# EAGLE schematic ETHERNET_PHY (EAGLE 8.4.0)
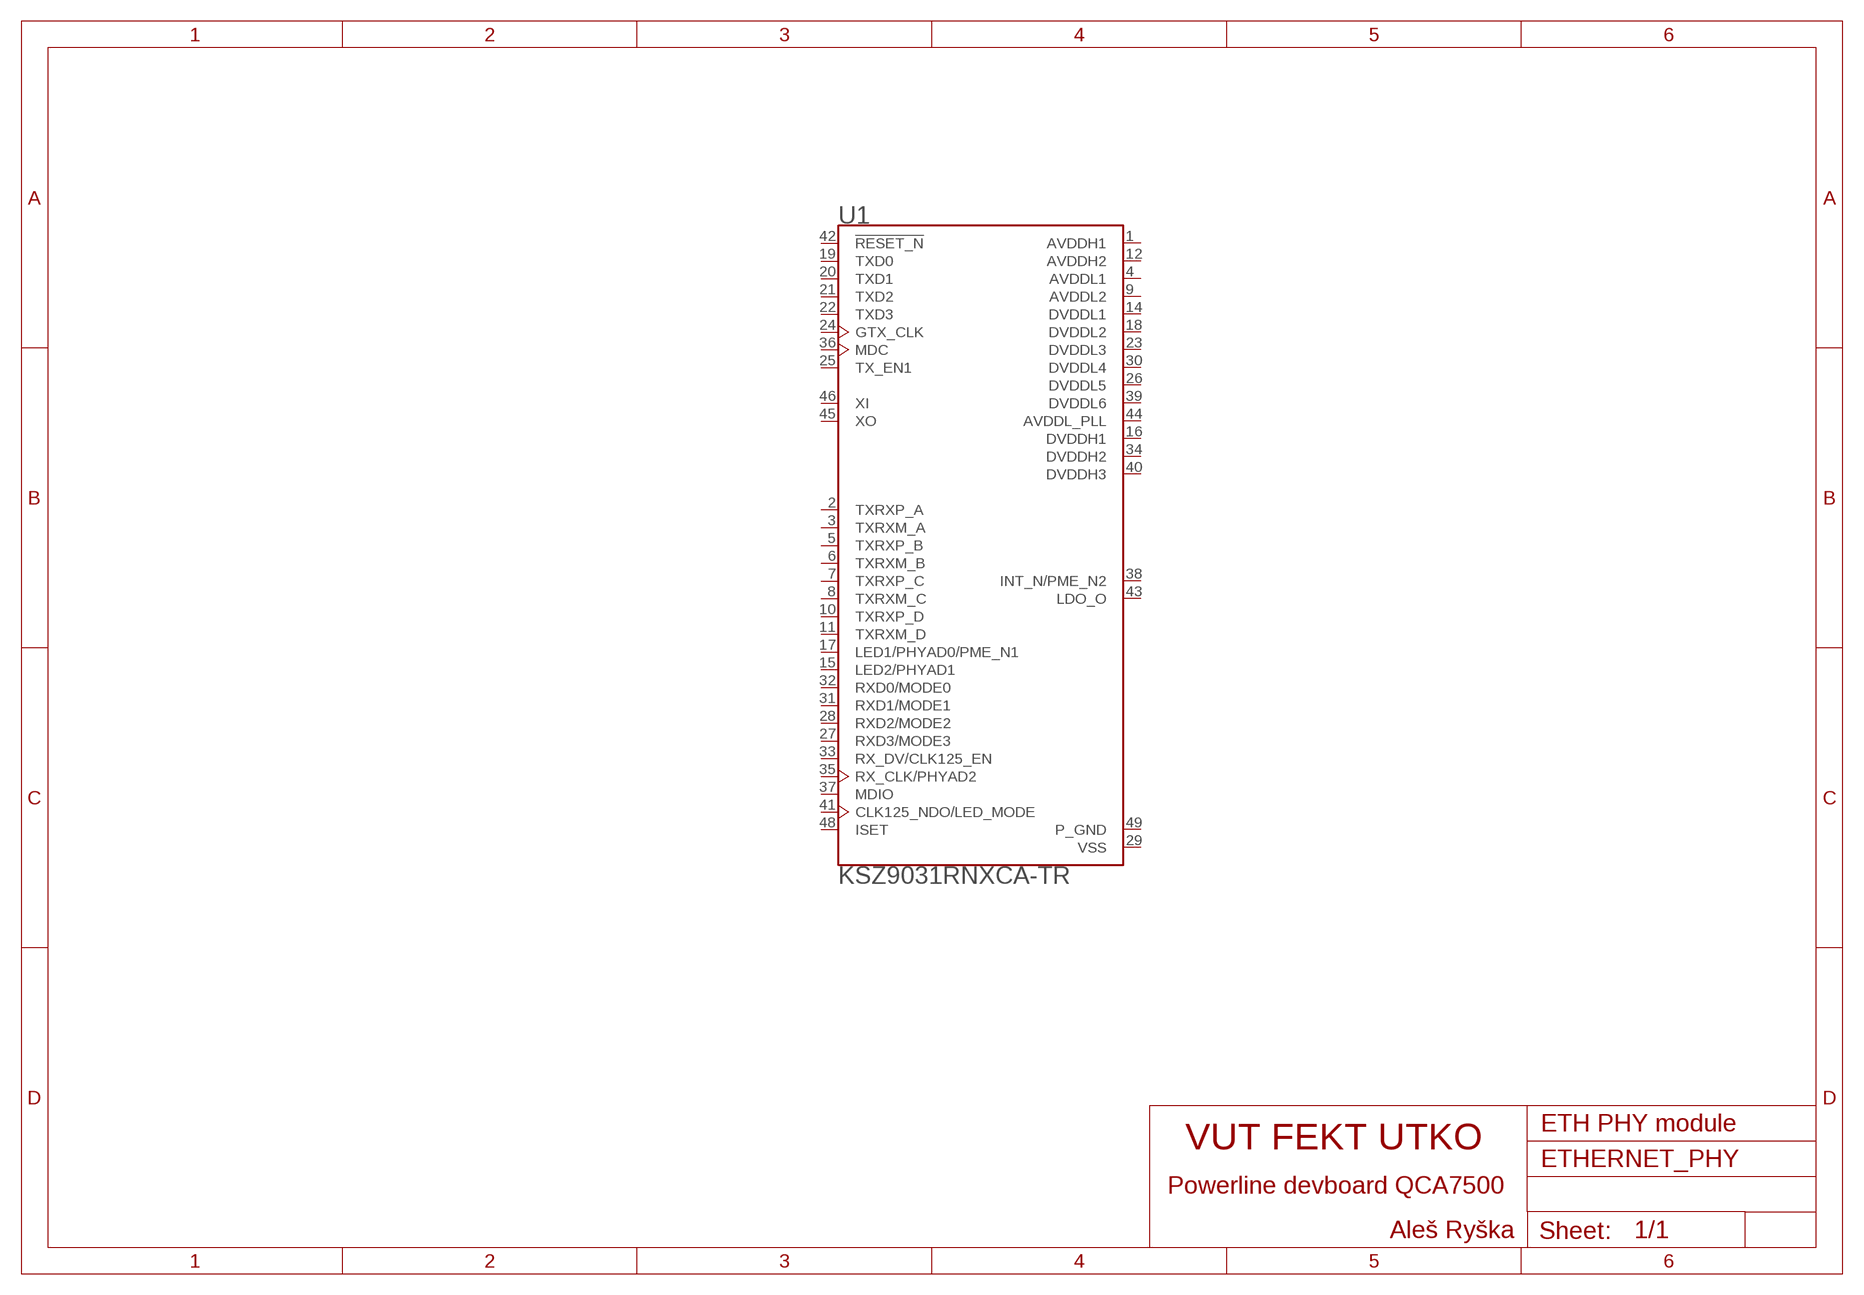
[diagram p0: schematic, sheet 1]

## Parts
U1  KSZ9031RNXCA-TR  [QFN50P700X700X90-49N]
Unconnected: U1.2(TXRXP_A) U1.3(TXRXM_A) U1.5(TXRXP_B) U1.6(TXRXM_B) U1.7(TXRXP_C) U1.8(TXRXM_C) U1.10(TXRXP_D) U1.11(TXRXM_D) U1.15(LED2/PHYAD1) U1.17(LED1/PHYAD0/PME_N1) U1.19(TXD0) U1.20(TXD1) U1.21(TXD2) U1.22(TXD3) U1.24(GTX_CLK) U1.25(TX_EN1) U1.27(RXD3/MODE3) U1.28(RXD2/MODE2) U1.31(RXD1/MODE1) U1.32(RXD0/MODE0) U1.33(RX_DV/CLK125_EN) U1.35(RX_CLK/PHYAD2) U1.36(MDC) U1.37(MDIO) U1.38(INT_N/PME_N2) U1.41(CLK125_NDO/LED_MODE) U1.42(!RESET_N) U1.43(LDO_O) U1.45(XO) U1.46(XI) U1.48(ISET)

## Notes on the sheet
- ETH PHY module
- VUT FEKT UTKO
- Powerline devboard QCA7500
- Aleš Ryška

## Power pins joined to a net without a drawn wire
AVDDH1: U1.1(AVDDH1)
AVDDH2: U1.12(AVDDH2)
AVDDL1: U1.4(AVDDL1)
AVDDL2: U1.9(AVDDL2)
AVDDL_PLL: U1.44(AVDDL_PLL)
DVDDH1: U1.16(DVDDH1)
DVDDH2: U1.34(DVDDH2)
DVDDH3: U1.40(DVDDH3)
DVDDL1: U1.14(DVDDL1)
DVDDL2: U1.18(DVDDL2)
DVDDL3: U1.23(DVDDL3)
DVDDL4: U1.30(DVDDL4)
DVDDL5: U1.26(DVDDL5)
DVDDL6: U1.39(DVDDL6)
P_GND: U1.49(P_GND)
VSS: U1.29(VSS)

## Library data of the parts
U1 = KSZ9031RNXCA-TR:KSZ9031RNXCA-TR: Ethernet TXRX Single Chip 1.8V/2.5V/3.3V 10Mbps/100Mbps/1000Mbps; AVAILABILITY: Good; DESCRIPTION: Ethernet TXRX Single Chip 1.8V/2.5V/3.3V 10Mbps/100Mbps/1000Mbps; MF: Microchip; MP: KSZ9031RNXCA-TR; PACKAGE: QFN-48 Microchip; PRICE: 4.33 USD